# Altium schematic sheet Microcontrôleur et capteur temp.SchDoc: MesureTH
size 276 x 198 mm; Date: 21.08.2024; CheckedBy: CFO; DrawnBy: MPT; Organization: ETML-ES; Address1: Av. Recordon 1bis; Address2: 1004 Lausanne; Address3: Suisse; DocumentNumber: 2409; SheetNumber: 3; SheetTotal: 5; CheckingDate: 26.08.2024
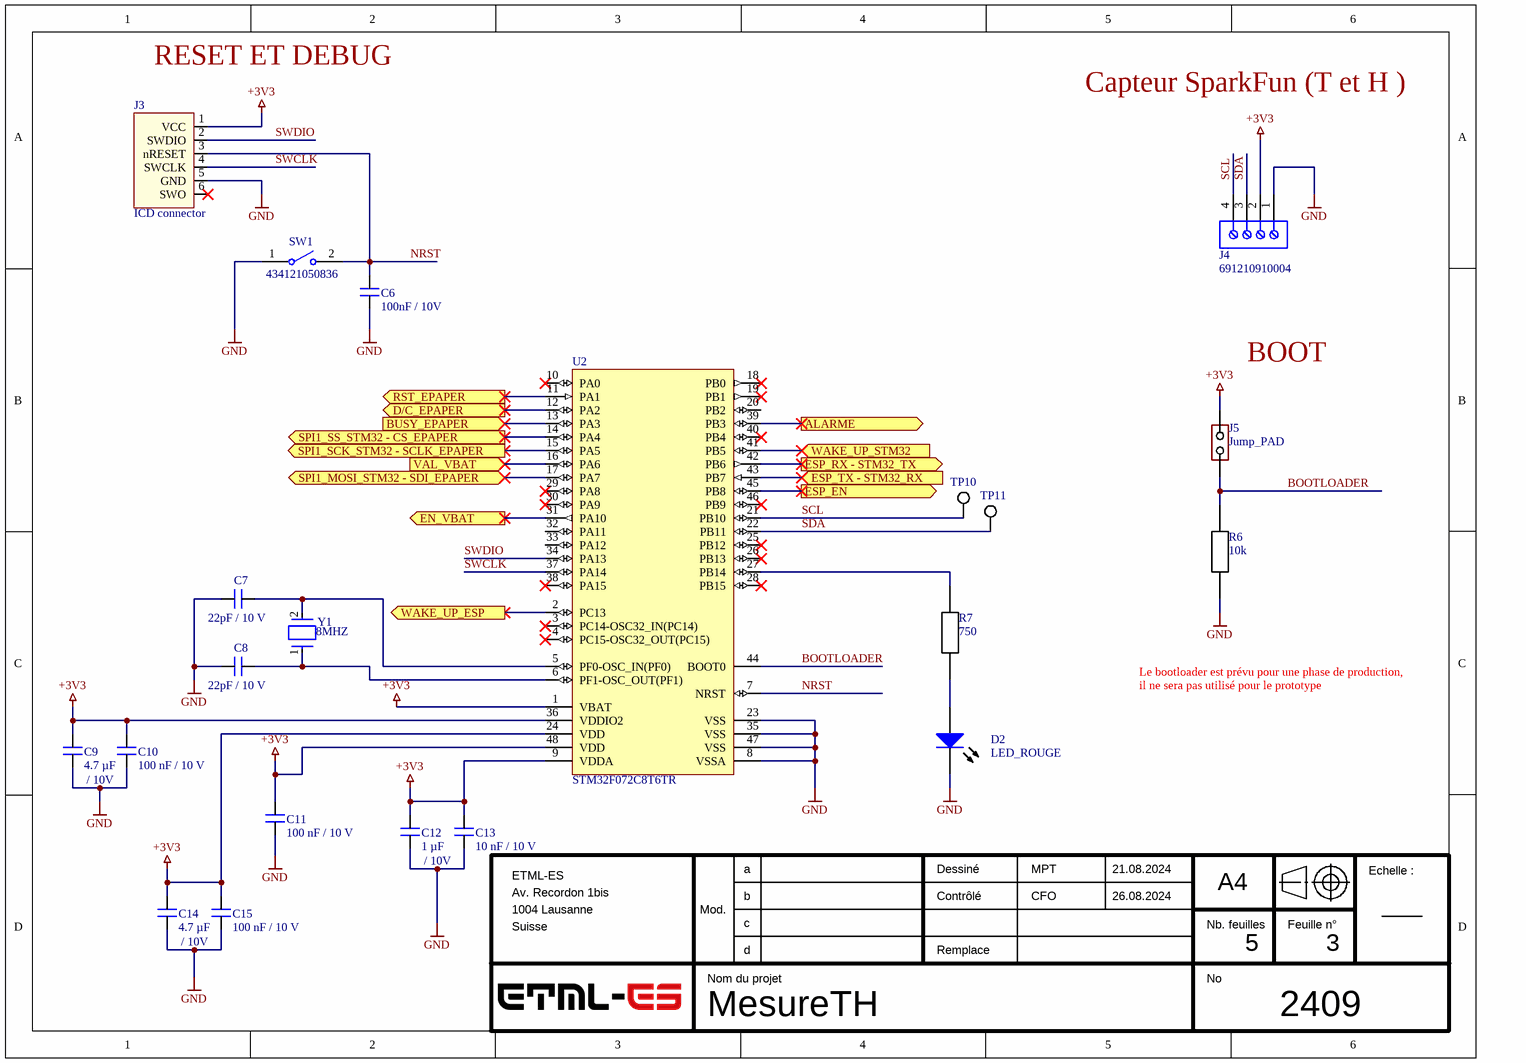
[diagram p0: Microcontrôleur et capteur temp.SchDoc]

## Parts
C6  100nF / 10V  [WCAP-CSGP_0805_L2W1.25H0.8_Wave]
C7  22pF / 10 V  [WCAP-CSGP_0805_L2W1.25H0.8_Wave]
C8  22pF / 10 V  [WCAP-CSGP_0805_L2W1.25H0.8_Wave]
C9  4.7 µF  [WCAP-CSGP_0805_L2W1.25H0.8_Wave]
C10  100 nF / 10 V  [WCAP-CSGP_0805_L2W1.25H0.8_Wave]
C11  100 nF / 10 V  [WCAP-CSGP_0805_L2W1.25H0.8_Wave]
C12  1 µF  [WCAP-CSGP_0805_L2W1.25H0.8_Wave]
C13  10 nF / 10 V  [WCAP-CSGP_0805_L2W1.25H0.8_Wave]
C14  4.7 µF  [WCAP-CSGP_0805_L2W1.25H0.8_Wave]
C15  100 nF / 10 V  [WCAP-CSGP_0805_L2W1.25H0.8_Wave]
D2  LED_ROUGE  [LED_SMD_B_AND_R]
J3  ICD connector  [TC2030-MCP]  (no BOM)
J4  691210910004  [691210910004]
J5  Jump_PAD  [Jump_PAD]
R6  10k  [WRIS-PSMB_0805_L2W1.25H0.35]
R7  750  [WRIS-PSMB_0805_L2W1.25H0.35]
SW1  434121050836  [WS-TASV_L6W3.5H5_4341x10508x6]
TP10  Test_Point_SMD  [5019]  (value not drawn)
TP11  Test_Point_SMD  [5019]  (value not drawn)
U2  STM32F072C8T6TR  [LQFP48-7x7mm]
Y1  8MHZ  [FP-ABLS-MFG]

## Ports
ALARME (out), BUSY_EPAPER (in), D/C_EPAPER (out), EN_VBAT (out), ESP_EN (out), ESP_RX - STM32_TX (out), ESP_TX - STM32_RX (in), RST_EPAPER (out), SPI1_MOSI_STM32 - SDI_EPAPER (bidir), SPI1_SCK_STM32 - SCLK_EPAPER (out), SPI1_SS_STM32 - CS_EPAPER (out), VAL_VBAT (in), WAKE_UP_ESP (out), WAKE_UP_STM32 (in)

## Nets
+3V3: C9.1(+) C10.1(+) C11.1(+) C12.1(+) C13.1(+) C14.1(+) C15.1(+) J3.1(VCC) J4.2 J5.2 U2.1(VBAT) U2.9(VDDA) U2.24(VDD) U2.36(VDDIO2) U2.48(VDD)
GND: C6.2(-) C7.1(+) C8.1(+) C9.2(-) C10.2(-) C11.2(-) C12.2(-) C13.2(-) C14.2(-) C15.2(-) D2.1(K) J3.5(GND) J4.1 R6.1 SW1.1 U2.8(VSSA) U2.23(VSS) U2.35(VSS) U2.47(VSS)
ALARME: U2.39(PB3) ; port ALARME
BOOTLOADER: J5.1 R6.2 U2.44(BOOT0)
BUSY_EPAPER: U2.13(PA3) ; port BUSY_EPAPER
D/C_EPAPER: U2.12(PA2) ; port D/C_EPAPER
EN_VBAT: U2.31(PA10) ; port EN_VBAT
ESP_EN: U2.45(PB8) ; port ESP_EN
ESP_RX - STM32_TX: U2.42(PB6) ; port ESP_RX - STM32_TX
ESP_TX - STM32_RX: U2.43(PB7) ; port ESP_TX - STM32_RX
NRST: C6.1(+) J3.3(nRESET) SW1.2 U2.7(NRST)
RST_EPAPER: U2.11(PA1) ; port RST_EPAPER
SCL: J4.4 TP10.1 U2.21(PB10)
SDA: J4.3 TP11.1 U2.22(PB11)
SPI1_MOSI_STM32 - SDI_EPAPER: U2.17(PA7) ; port SPI1_MOSI_STM32 - SDI_EPAPER
SPI1_SCK_STM32 - SCLK_EPAPER: U2.15(PA5) ; port SPI1_SCK_STM32 - SCLK_EPAPER
SPI1_SS_STM32 - CS_EPAPER: U2.14(PA4) ; port SPI1_SS_STM32 - CS_EPAPER
SWCLK: J3.4(SWCLK) U2.37(PA14)
SWDIO: J3.2(SWDIO) U2.34(PA13)
VAL_VBAT: U2.16(PA6) ; port VAL_VBAT
WAKE_UP_ESP: U2.2(PC13) ; port WAKE_UP_ESP
WAKE_UP_STM32: U2.41(PB5) ; port WAKE_UP_STM32
NetC7_2: C7.2(-) U2.5(PF0-OSC_IN(PF0)) Y1.2
NetC8_2: C8.2(-) U2.6(PF1-OSC_OUT(PF1)) Y1.1
NetD2_2: D2.2(A) R7.1
NetR7_2: R7.2 U2.27(PB14)

Not connected (* = marked no-connect by the designer): J3 6(SWO)*; U2 3(PC14-OSC32_IN(PC14))* 4(PC15-OSC32_OUT(PC15))* 10(PA0)* 18(PB0)* 19(PB1)* 20(PB2) 25(PB12)* 26(PB13)* 28(PB15)* 29(PA8)* 30(PA9)* 32(PA11) 33(PA12) 38(PA15)* 40(PB4)* 46(PB9)*

## Notes on the sheet
- RESET ET DEBUG
- Capteur SparkFun (T et H )
- BOOT
- Le bootloader est prévu pour une phase de production,
- il ne sera pas utilisé pour le prototype
- / 10V
- a
- Dessiné
- A4
- Echelle :
- Mod.
- b
- c
- d
- Contrôlé
- Remplace
- Nb. feuilles
- Feuille n°
- Nom du projet
- No

## Library data of the parts
C6-C15 = CAPA: Tension: *
D2 = LED
J3 = TC2030-MCP-NL: Conector par STlinj
J4 = CMP-1502-02458-2: NexarPartId: 105950651
J5 = Jump_PAD: jump pad smd
R6 R7 = Resistance
SW1 = CMP-1459-00008-2: NexarPartId: 57114500; Throw Configuration: SPST; Switch Travel: 250µm; Switch Function: Off-Mom; Current Rating: 50mA; Illumination Type: Non-Illuminated; Mechanical Life: 50kcycles; Voltage Rating: 12V; Insulation Resistance: 100MΩ; Actuator Material: Liquid Crystal Polymer, Polymer; Packaging: Tape and Reel; Min Operating Temperature: -40°C; Height: 5mm; Termination: SMD/SMT; Max Operating Temperature: 85°C; RoHS: Compliant; Contact Plating: Silver
U2 = STM32F072C8T6TR: ARM Cortex-M0 32-bit MCU, 64 KB Flash, 16 KB Internal RAM, 37 I/Os, 48-Pin LQFP, -40 to 85 degC, Tray; Manufacturer: STMicroelectronics; Operating Frequency(F) (Processor speed) (MHz): 48; FLASH Size (Prog) (kB): 64; I/Os (High Current): 37; D/A Converter: 1; Internal RAM Size (kB): 16; Supply Voltage(Vcc) min (V): 2; Package Reference: LQFP48; DatasheetVersion: Rev. 5; Core: ARM Cortex-M0; ComponentLink1Description: Manufacturer URL; ComponentLink1URL: http://www.st.com/; Packing: Tray; Mounting Technology: Surface Mount; Package Description: 48-Pin Low Profile Quad Flat Package, Body 7 x 7 mm, Pitch 0.5 mm; ComponentLink2URL: http://www.st.com/st-web-ui/static/active/en/resource/technical/document/datasheet/DM00090510.pdf; ComponentLink2Description: Datasheet; PartNumber: STM32F072C8T6
Y1 = CMP-27762-009874-1: CRYSTAL 8.0000MHZ 18PF SMD; ESR (Equivalent Series Resistance): 80R; Frequency Stability: 50ppm; Tolerance: 20ppm; Min Operating Temperature: -20°C; Lead Free: Lead Free; Operating Frequency: 8 MHz; Width: 4.7mm; Packaging: Tape and Reel; Series: ABLS; Accuracy: 20ppm; Length: 11.4mm; Frequency Tolerance: 20ppm; Termination: SMD/SMT; Number of Pins: 2; Radiation Hardening: No; Depth: 4.7mm; REACH SVHC: No SVHC; Contact Plating: Tin; Load Capacitance: 18pF; Case/Package: SMD/SMT; Mount: Surface Mount; Package Quantity: 1000; Max Operating Temperature: 70°C; Height: 0.165inch; Frequency: 8MHz; Series Resistance: 80R